# EAGLE schematic ME588_FinalProject_Team6_Schematics (EAGLE 9.6.2)
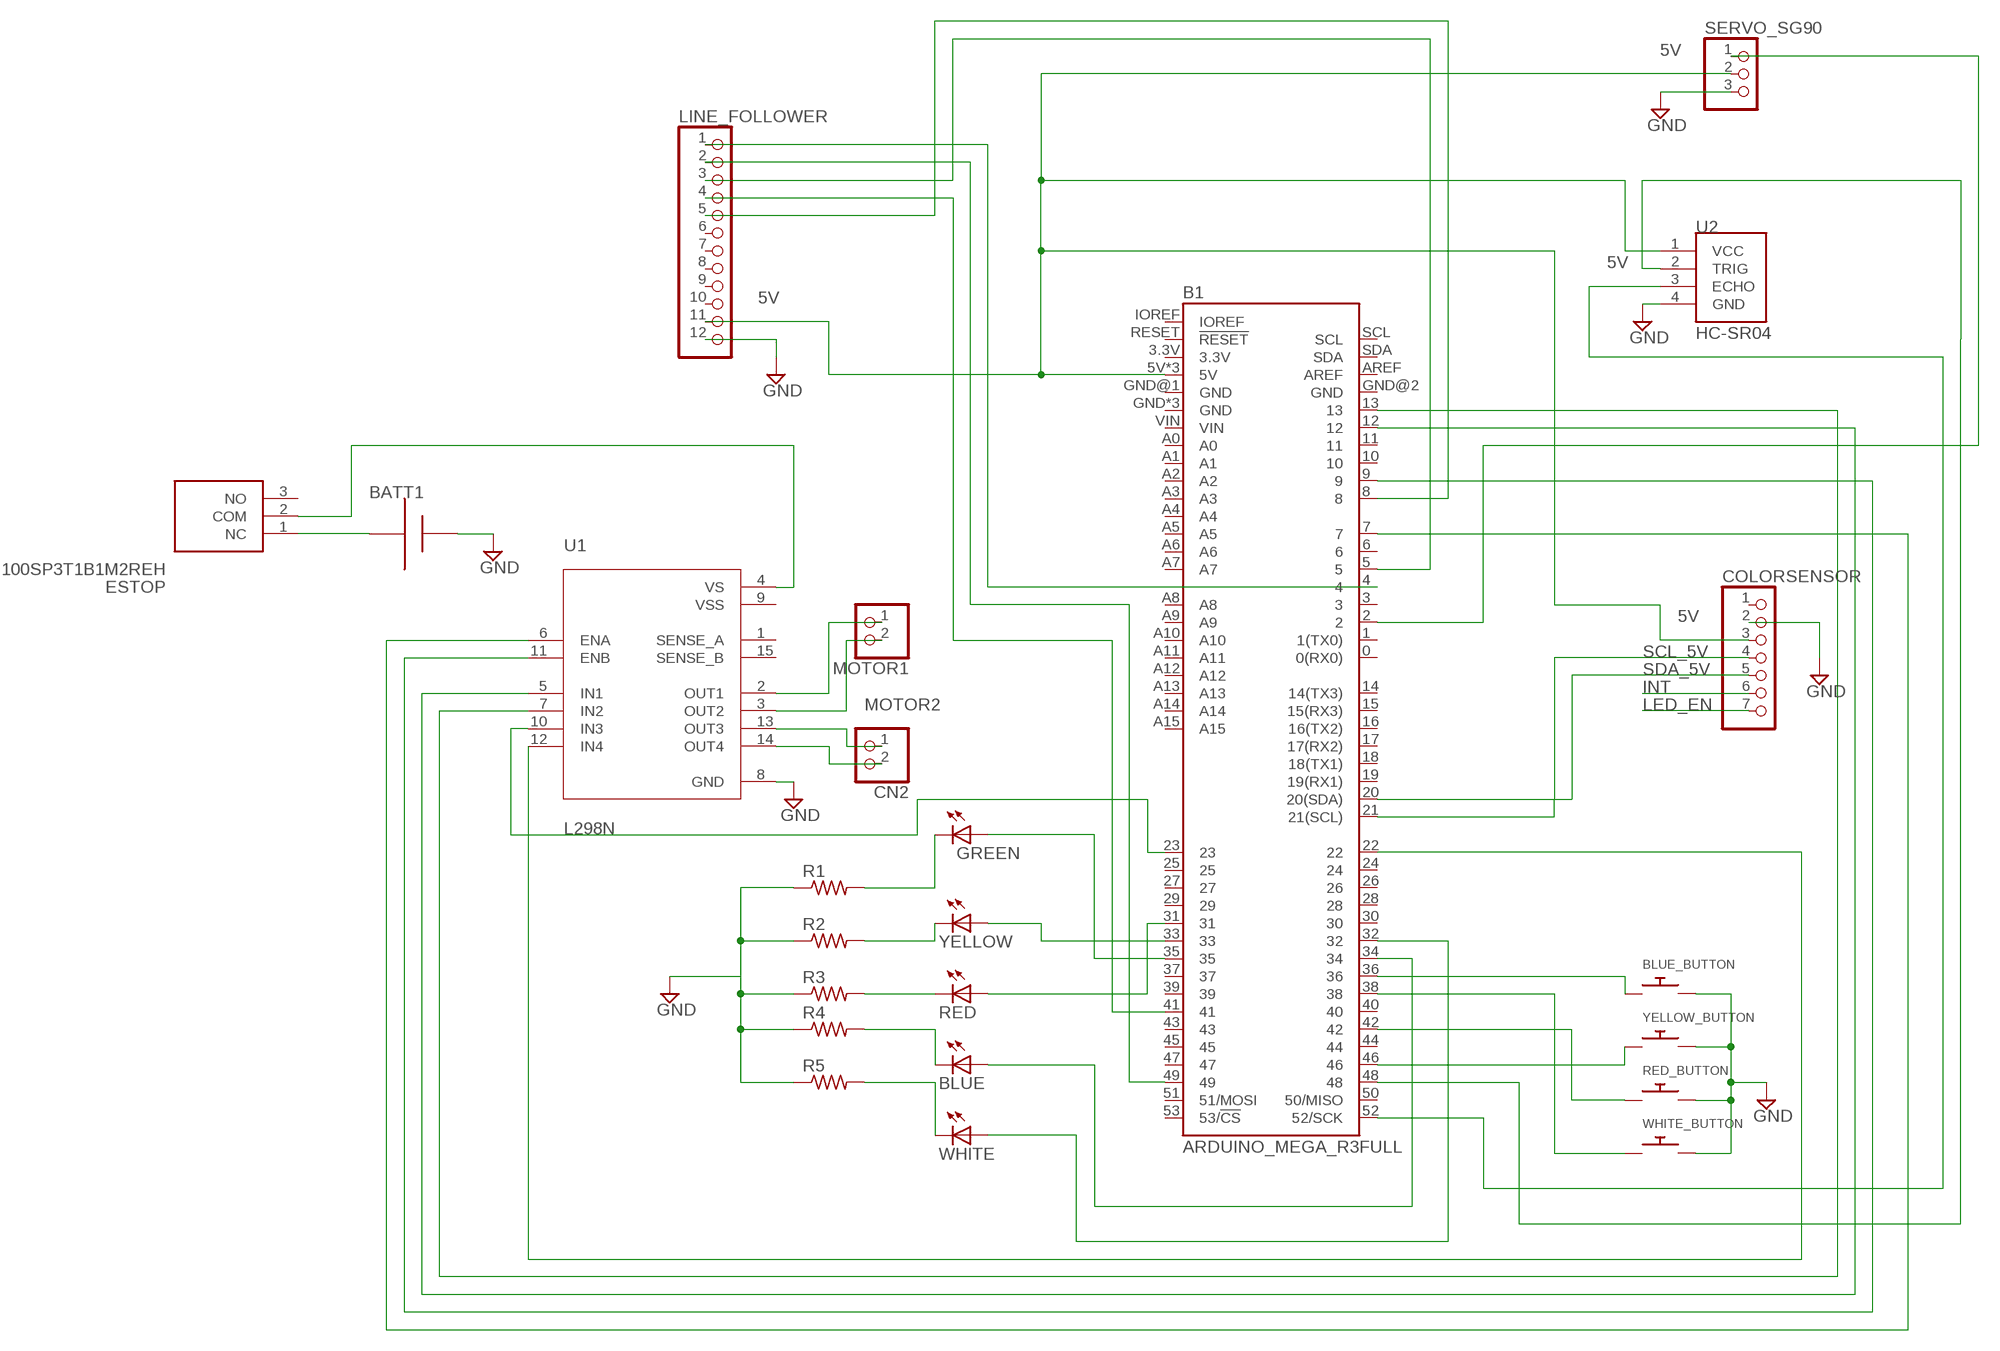
[diagram p0: schematic, sheet 1]

## Parts
B1  ARDUINO_MEGA_R3FULL  [ARDUINO_MEGA_NO_SILK]
BATT1  AAA  [12BH412]
BLUE  LED5MM  [LED5MM]
BLUE_BUTTON  SWITCH_PUSHBUTTONC&K_KSS  [BTN_CK_KSS]
CN2  JST_2PIN-SMT-RA  [JST-PH-2-SMT-RA]
COLORSENSOR  HEADER-1X770MIL  [1X07_ROUND_70]
ESTOP  100SP3T1B1M2REH  [100SP3T1B1M2REH]
GREEN  LED5MM  [LED5MM]
LINE_FOLLOWER  PINHD-1X12  [1X12]
MOTOR1  JST_2PIN-SMT-RA  [JST-PH-2-SMT-RA]
R1  R-US_0204/2V  [0204V]
R2  R-US_0204/2V  [0204V]
R3  R-US_0204/2V  [0204V]
R4  R-US_0204/2V  [0204V]
R5  R-US_0204/2V  [0204V]
RED  LED5MM  [LED5MM]
RED_BUTTON  SWITCH_PUSHBUTTONC&K_KSS  [BTN_CK_KSS]
SERVO_SG90  PINHD-1X3CB  [1X03-CLEANBIG]
U1  L298N  [TO127P2020X500X2100-15]
U2  HC-SR04  [XCVR_HC-SR04]
WHITE  LED5MM  [LED5MM]
WHITE_BUTTON  SWITCH_PUSHBUTTONC&K_KSS  [BTN_CK_KSS]
YELLOW  LED5MM  [LED5MM]
YELLOW_BUTTON  SWITCH_PUSHBUTTONC&K_KSS  [BTN_CK_KSS]

## Nets
5V: B1.5V B1.5V@1(5V) B1.5V@2(5V) COLORSENSOR.3 LINE_FOLLOWER.11 SERVO_SG90.2 U2.1(VCC)
GND: BATT1.+ BLUE_BUTTON.P$2 COLORSENSOR.2 LINE_FOLLOWER.12 R1.1 R2.1 R3.1 R4.1 R5.1 RED_BUTTON.P$2 SERVO_SG90.3 U1.8(GND) U2.4(GND) WHITE_BUTTON.P$2 YELLOW_BUTTON.P$2
INT: COLORSENSOR.6
LED_EN: COLORSENSOR.7
MOTOR2: CN2.1 U1.13(OUT3)
N$1: GREEN.K(C) R1.2
N$2: R2.2 YELLOW.K(C)
N$3: R3.2 RED.K(C)
N$4: BLUE.K(C) R4.2
N$5: R5.2 WHITE.K(C)
N$6: B1.35 GREEN.A
N$7: B1.33 YELLOW.A
N$8: B1.31 RED.A
N$9: B1.34 BLUE.A
N$10: B1.32 WHITE.A
N$11: B1.36 BLUE_BUTTON.P$1
N$12: B1.46 YELLOW_BUTTON.P$1
N$13: B1.42 RED_BUTTON.P$1
N$14: BATT1.- ESTOP.1(NC)
N$15: B1.38 WHITE_BUTTON.P$1
N$16: MOTOR1.1 U1.2(OUT1)
N$17: ESTOP.2(COM) U1.4(VS)
N$18: MOTOR1.2 U1.3(OUT2)
N$19: B1.7 U1.6(ENA)
N$20: CN2.2 U1.14(OUT4)
N$21: B1.9 U1.11(ENB)
N$22: B1.12 U1.5(IN1)
N$23: B1.13 U1.7(IN2)
N$24: B1.23 U1.10(IN3)
N$25: B1.22 U1.12(IN4)
N$26: B1.48 U2.2(TRIG)
N$27: B1.2 SERVO_SG90.1
N$28: B1.52(52/SCK) U2.3(ECHO)
N$29: B1.4 LINE_FOLLOWER.1
N$30: B1.49 LINE_FOLLOWER.2
N$31: B1.5 LINE_FOLLOWER.3
N$32: B1.8 LINE_FOLLOWER.5
N$33: B1.41 LINE_FOLLOWER.4
SCL_5V: B1.21(21(SCL)) COLORSENSOR.4
SDA_5V: B1.20(20(SDA)) COLORSENSOR.5
Unconnected: B1.0(0(RX0)) B1.1(1(TX0)) B1.3 B1.3.3V B1.6 B1.10 B1.11 B1.14(14(TX3)) B1.15(15(RX3)) B1.16(16(TX2)) B1.17(17(RX2)) B1.18(18(TX1)) B1.19(19(RX1)) B1.24 B1.25 B1.26 B1.27 B1.28 B1.29 B1.30 B1.37 B1.39 B1.40 B1.43 B1.44 B1.45 B1.47 B1.50(50/MISO) B1.51(51/MOSI) B1.53(53/!CS) B1.A0 B1.A1 B1.A2 B1.A3 B1.A4 B1.A5 B1.A6 B1.A7 B1.A8 B1.A9 B1.A10 B1.A11 B1.A12 B1.A13 B1.A14 B1.A15 B1.AREF B1.GND B1.GND@1(GND) B1.GND@2(GND) B1.GND@3(GND) B1.GND@4(GND) B1.IOREF B1.RESET(!RESET) B1.SCL B1.SDA B1.VIN COLORSENSOR.1 ESTOP.3(NO) LINE_FOLLOWER.6 LINE_FOLLOWER.7 LINE_FOLLOWER.8 LINE_FOLLOWER.9 LINE_FOLLOWER.10 U1.1(SENSE_A) U1.9(VSS) U1.15(SENSE_B)

## Library data of the parts
B1 = SparkFun-Boards:ARDUINO_MEGA_R3: Arduino Mega R3 ATmega2560 R3 compatible footprint. SparkFun Products: Arduino Mega 2560 R3 <https://www.sparkfun.com/products/11061>
BATT1 = adafruit:AAA: AAA PC pin holder Mouser part #12BH412 - but pretty much any 1x AAA battery holder should be the same http://www.ladyada.net/library/pcb/eaglelibrary.html
BLUE GREEN RED WHITE YELLOW = adafruit:LED: LED OSRAM: - CHIPLED LG R971, LG N971, LY N971, LG Q971, LY Q971, LO R971, LY R971 LH N974, LH R974 LS Q976, LO Q976, LY Q976 LO Q996 - Hyper CHIPLED LW Q18S LB Q993, LB Q99A, LB R99A - SideLED LS A670, LO A670, LY A670, LG A670, LP A670 LB A673, LV A673, LT A673, LW A673 LH A674 LY A675 LS A676, LA A676, LO A676, LY A676, LW A676 LS A679, LY A679, LG A679 - Hyper Micro SIDELED® LS Y876, LA Y876, LO Y876, LY Y876 LT Y87S - SmartLED LW L88C, LW L88S LB L89C, LB L89S, LG L890 LS L89K, LO L89K, LY L89K LS L896, LA L896, LO L896, LY L896 - TOPLED LS T670, LO T670, LY T670, LG T670, LP T670 LSG T670, LSP T670, LSY T670, LOP T670, LYG T670 LG T671, LOG T671, LSG T671 LB T673, LV T673, LT T673, LW T673 LH T674 LS T676, LA T676, LO T676, LY T676, LB T676, LH T676, LSB T676, LW T676 LB T67C, LV T67C, LT T67C, LS T67K, LO T67K, LY T67K, LW E67C LS E67B, LA E67B, LO E67B, LY E67B, LB E67C, LV E67C, LT E67C LW T67C LS T679, LY T679, LG T679 LS T770, LO T770, LY T770, LG T770, LP T770 LB T773, LV T773, LT T773, LW T773 LH T774 LS E675, LA E675, LY E675, LS T675 LS T776, LA T776, LO T776, LY T776, LB T776 LHGB T686 LT T68C, LB T68C - Hyper Mini TOPLED® LB M676 - Mini TOPLED Santana® LG M470 LS M47K, LO M47K, LY M47K Source: http://www.osram.convergy.de/
BLUE_BUTTON RED_BUTTON WHITE_BUTTON YELLOW_BUTTON = adafruit:SWITCH_PUSHBUTTON: Buttons SOFTTOUCHSMD_SJ - Soft touch temporary push button (Super Junk Akihabara) Compatible with SKPMANE010 [Mouser: 688-SKPMAN] C&K_KSS = Digikey: KSS221GLFS
CN2 MOTOR1 = adafruit:JST_2PIN: JST 2-Pin Connectors of various flavors SMT-RA (S2B-PH-SM4) 4UConnector #17311 SMT (B2B-PH-SM4) THM-RA (S2B-PH) THM (B2B-PH)
COLORSENSOR = microbuilder:HEADER-1X7: PIN HEADER
ESTOP = 100SP3T1B1M2REH:100SP3T1B1M2REH: Toggle Switches 0.4VA @ 20V (AC/DC) On-Off-On PC Mnt.. Source: Datasheet <http://spec_sheets.e-switch.com/specs/ST113073.pdf>; DESCRIPTION: Toggle Switches 0.4VA @ 20V (AC/DC) On-Off-On PC Mnt..; HEIGHT: 28.44mm; MANUFACTURER_NAME: E-Switch; MANUFACTURER_PART_NUMBER: 100SP3T1B1M2REH
LINE_FOLLOWER = adafruit:PINHD-1X12: PIN HEADER
R1-R5 = rcl:R-US_: RESISTOR, American symbol; SPICEPREFIX: R
SERVO_SG90 = adafruit:PINHD-1X3: PIN HEADER
U1 = L298N:L298N: Dual Full Bridge Motor Driver 15-Pin(15+Tab) MULTIWATT V Tube Check availability <https://pricing.snapeda.com/parts/L298N/Magnatec/view-part?ref=eda>; AVAILABILITY: Not in stock; DESCRIPTION: Stepper motor controller,L298N 4.5-46V; MF: Magnatec; MP: L298N; PACKAGE: None; PRICE: None
U2 = HC-SR04:HC-SR04: Ultrasonic Sensor Module Check availability <https://pricing.snapeda.com/parts/HC-SR04/SparkFun%20Electronics/view-part?ref=eda>; AVAILABILITY: In Stock; DESCRIPTION: HC-SR04 Ultrasonic Sensor Qwiic Platform Evaluation Expansion Board; MF: SparkFun Electronics; MP: HC-SR04; PACKAGE: None; PRICE: None; PURCHASE-URL: https://pricing.snapeda.com/search/part/HC-SR04/?ref=eda